# Altium schematic sheet Overview.SchDoc
size A2; SheetNumber: 2; SheetTotal: 12
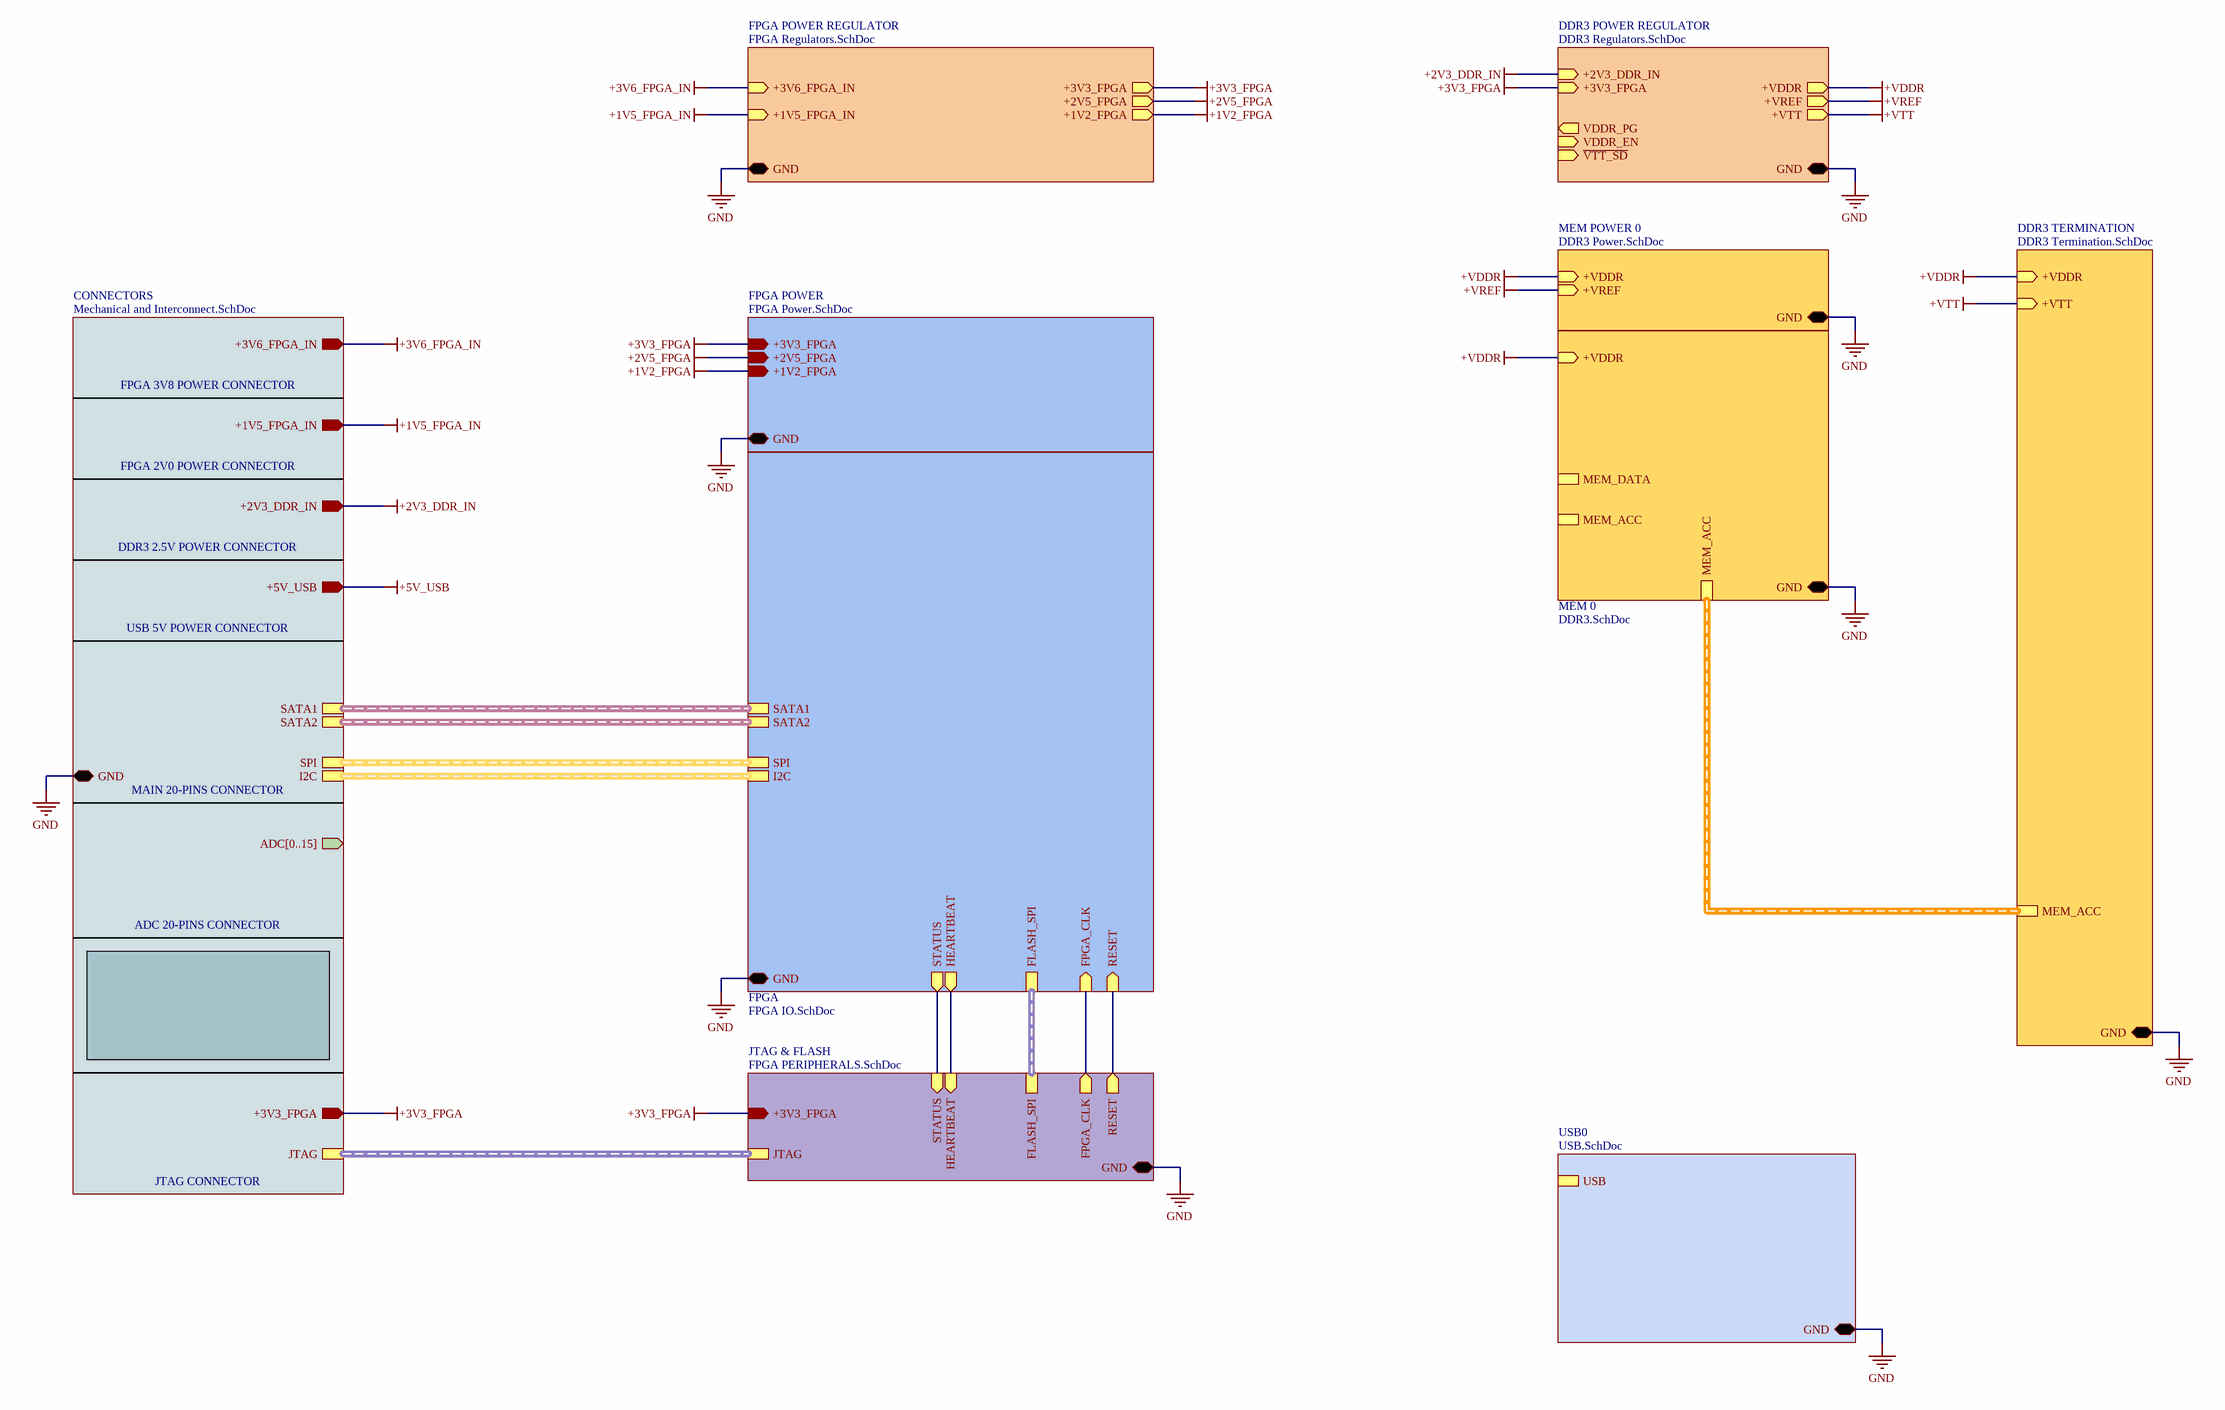
[diagram p0: Overview.SchDoc]

## Sub-sheets
CONNECTORS = Mechanical and Interconnect.SchDoc: JTAG (harness JTAG), SATA2 (harness SATA), ADC[0..15] (out), SPI (harness SPI), SATA1 (harness SATA), +5V_USB (out), +3V6_FPGA_IN (out), +3V3_FPGA (out), +2V3_DDR_IN (out), GND (bidir), I2C (harness I2C), +1V5_FPGA_IN (out)
DDR3 POWER REGULATOR = DDR3 Regulators.SchDoc: GND (bidir), VDDR_EN (in), +VDDR (out), +3V3_FPGA (in), +VREF (out), +VTT (out), ~{VTT_SD} (in), VDDR_PG (out), +2V3_DDR_IN (in)
DDR3 TERMINATION = DDR3 Termination.SchDoc: GND (bidir), +VTT (in), +VDDR (in), MEM_ACC (harness MEM_ACC)
FPGA = FPGA IO.SchDoc: FLASH_SPI (harness FLASH_SPI), GND (bidir), SATA2 (harness SATA), SPI (harness SPI), I2C (harness I2C), SATA1 (harness SATA), RESET (in), HEARTBEAT (out), STATUS (out), FPGA_CLK (in)
FPGA POWER = FPGA Power.SchDoc: GND (bidir), +3V3_FPGA (in), +2V5_FPGA (in), +1V2_FPGA (in)
FPGA POWER REGULATOR = FPGA Regulators.SchDoc: GND (bidir), +1V5_FPGA_IN (in), +3V6_FPGA_IN (in), +1V2_FPGA (out), +2V5_FPGA (out), +3V3_FPGA (out)
JTAG & FLASH = FPGA PERIPHERALS.SchDoc: JTAG (harness JTAG), FLASH_SPI (harness FLASH_SPI), +3V3_FPGA (in), GND (bidir), STATUS (in), HEARTBEAT (in), RESET (out), FPGA_CLK (out)
MEM 0 = DDR3.SchDoc: GND (bidir), +VDDR (in), MEM_DATA (harness MEM0_DATA), MEM_ACC (harness MEM_ACC), MEM_ACC (harness MEM_ACC)
MEM POWER 0 = DDR3 Power.SchDoc: GND (bidir), +VDDR (in), +VREF (in)
USB0 = USB.SchDoc: USB (harness USB), GND (bidir)

## Nets
+1V2_FPGA: sheet FPGA POWER/+1V2_FPGA, sheet FPGA POWER REGULATOR/+1V2_FPGA
+1V5_FPGA_IN: sheet CONNECTORS/+1V5_FPGA_IN, sheet FPGA POWER REGULATOR/+1V5_FPGA_IN
+2V3_DDR_IN: sheet CONNECTORS/+2V3_DDR_IN, sheet DDR3 POWER REGULATOR/+2V3_DDR_IN
+2V5_FPGA: sheet FPGA POWER/+2V5_FPGA, sheet FPGA POWER REGULATOR/+2V5_FPGA
+3V3_FPGA: sheet JTAG & FLASH/+3V3_FPGA, sheet FPGA POWER/+3V3_FPGA, sheet CONNECTORS/+3V3_FPGA, sheet DDR3 POWER REGULATOR/+3V3_FPGA, sheet FPGA POWER REGULATOR/+3V3_FPGA
+3V6_FPGA_IN: sheet CONNECTORS/+3V6_FPGA_IN, sheet FPGA POWER REGULATOR/+3V6_FPGA_IN
+5V_USB: sheet CONNECTORS/+5V_USB
+VDDR: sheet DDR3 POWER REGULATOR/+VDDR, sheet MEM POWER 0/+VDDR, sheet MEM 0/+VDDR, sheet DDR3 TERMINATION/+VDDR
+VREF: sheet DDR3 POWER REGULATOR/+VREF, sheet MEM POWER 0/+VREF
+VTT: sheet DDR3 POWER REGULATOR/+VTT, sheet DDR3 TERMINATION/+VTT
GND: sheet FPGA/GND, sheet JTAG & FLASH/GND, sheet FPGA POWER/GND, sheet CONNECTORS/GND, sheet DDR3 POWER REGULATOR/GND, sheet MEM POWER 0/GND, sheet MEM 0/GND, sheet DDR3 TERMINATION/GND, sheet USB0/GND, sheet FPGA POWER REGULATOR/GND
(unnamed): sheet FPGA/RESET, sheet JTAG & FLASH/RESET
(unnamed): sheet FPGA/HEARTBEAT, sheet JTAG & FLASH/HEARTBEAT
(unnamed): sheet FPGA/STATUS, sheet JTAG & FLASH/STATUS
(unnamed): sheet FPGA/FPGA_CLK, sheet JTAG & FLASH/FPGA_CLK

## Buses and harness runs
harness sheet CONNECTORS/I2C = sheet FPGA/I2C
harness sheet CONNECTORS/JTAG = sheet JTAG & FLASH/JTAG
harness sheet CONNECTORS/SATA1 = sheet FPGA/SATA1
harness sheet CONNECTORS/SATA2 = sheet FPGA/SATA2
harness sheet CONNECTORS/SPI = sheet FPGA/SPI
harness sheet DDR3 TERMINATION/MEM_ACC = sheet MEM 0/MEM_ACC
harness sheet FPGA/FLASH_SPI = sheet JTAG & FLASH/FLASH_SPI

## Notes on the sheet
- FPGA 3V8 POWER CONNECTOR
- FPGA 2V0 POWER CONNECTOR
- DDR3 2.5V POWER CONNECTOR
- USB 5V POWER CONNECTOR
- MAIN 20-PINS CONNECTOR
- ADC 20-PINS CONNECTOR
- JTAG CONNECTOR